# EAGLE schematic H02 (EAGLE 6.6.0)

## Sheet 1 of 3
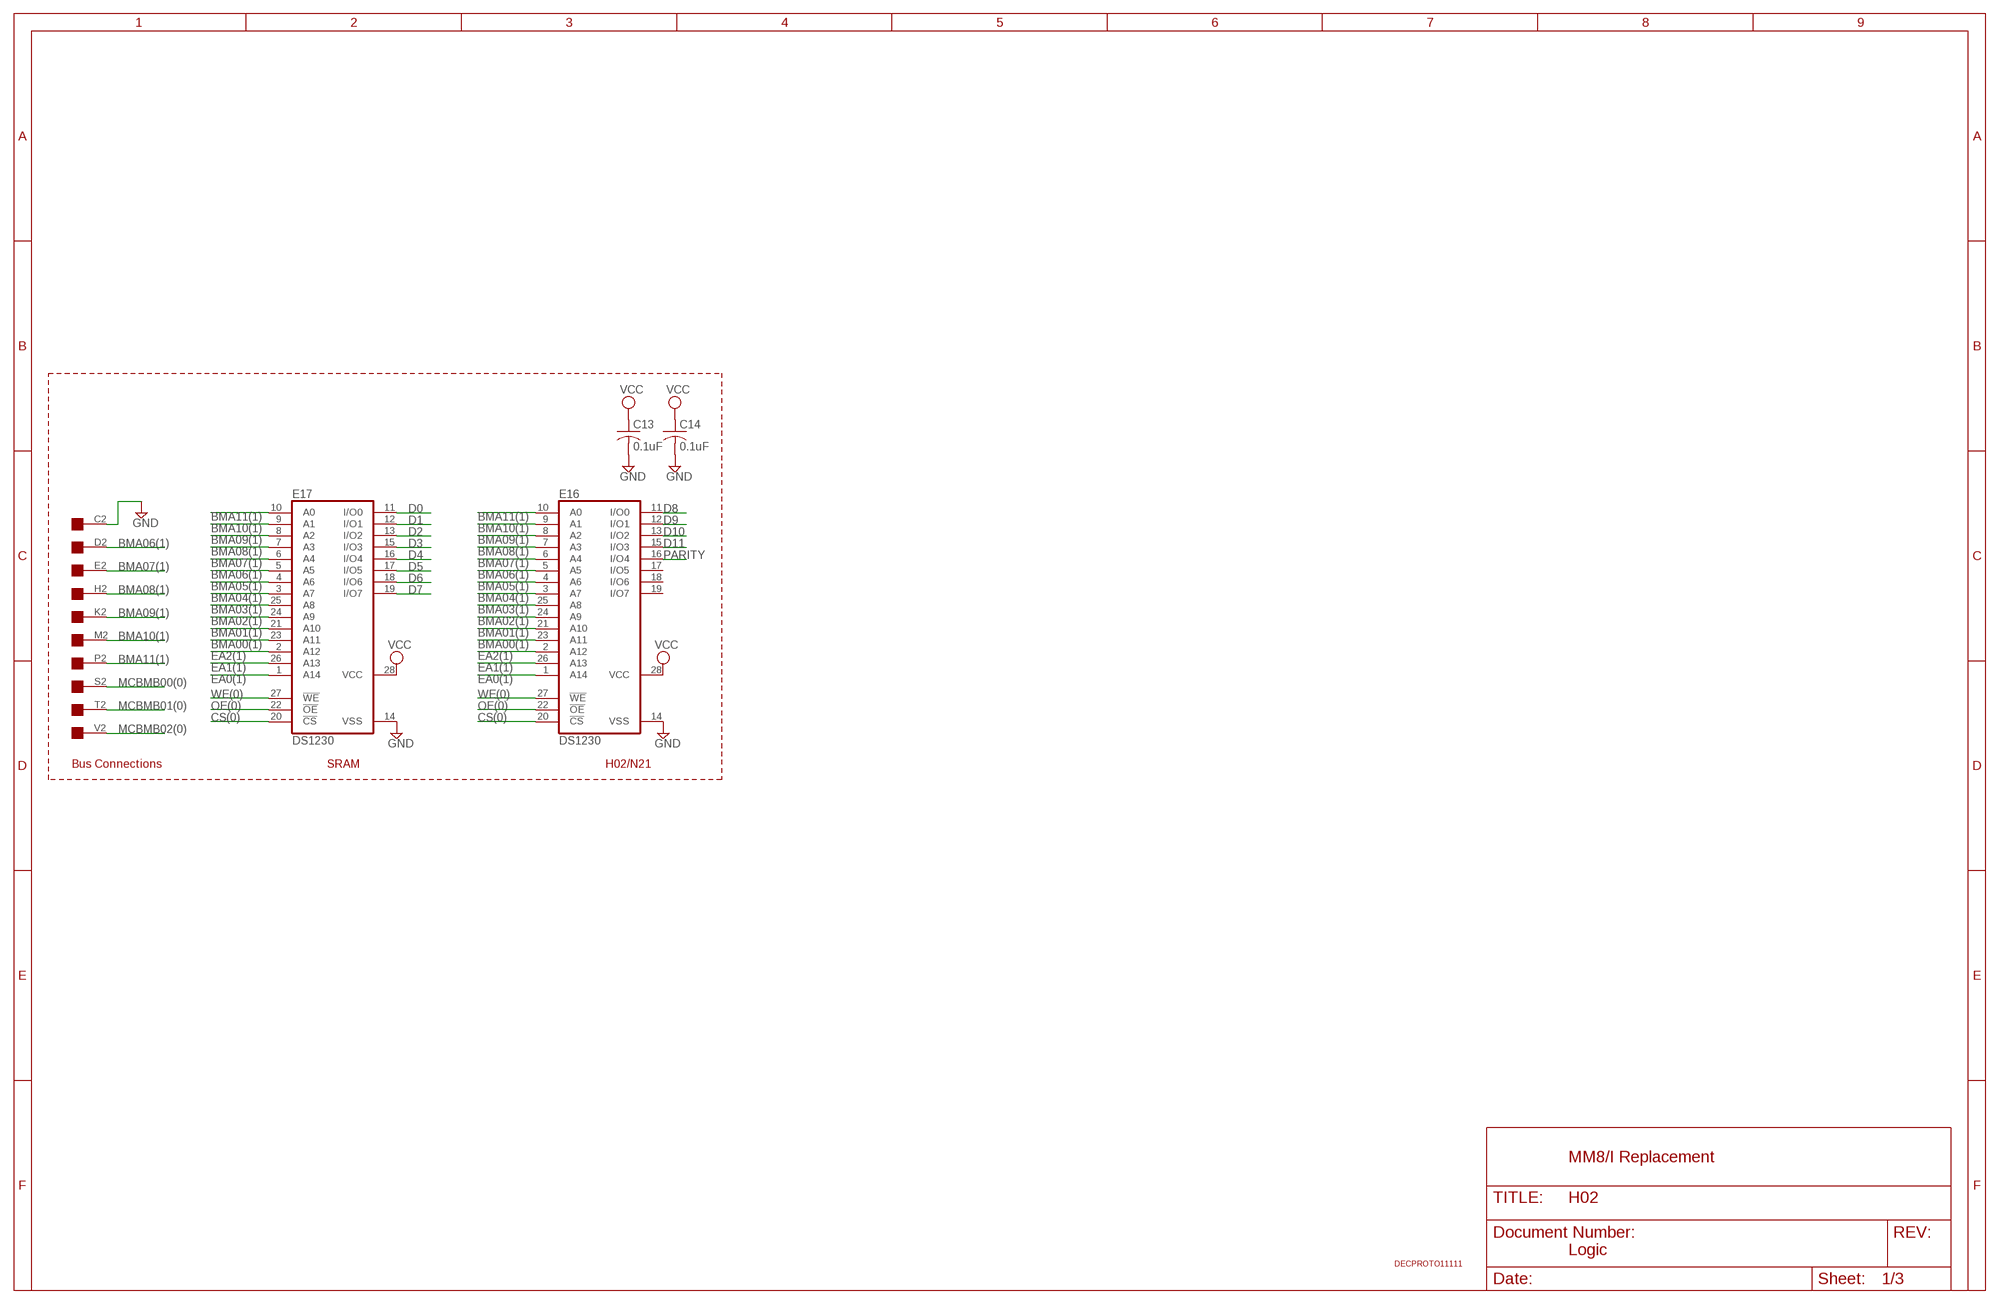
[diagram p0: schematic, sheet 1]

### Parts
C13  0.1uF  C-US050-025X075  [C050-025X075]
C14  0.1uF  C-US050-025X075  [C050-025X075]
E16  DS1230  62256P  [DIL28-6]
E17  DS1230  62256P  [DIL28-6]
H02  EDGE-1  [EDGE-CON1]
U$6  DECPROTO11111  [DECPROTO11111]

### Nets
BMA00(1): E16.23(A11) E17.23(A11) ; also sheet 2
BMA01(1): E16.21(A10) E17.21(A10) ; also sheet 2
BMA02(1): E16.24(A9) E17.24(A9) ; also sheet 2
BMA03(1): E16.25(A8) E17.25(A8) ; also sheet 2
BMA04(1): E16.3(A7) E17.3(A7) ; also sheet 2
BMA05(1): E16.4(A6) E17.4(A6) ; also sheet 2
BMA06(1): E16.5(A5) E17.5(A5) H02.D2 ; also sheet 2
BMA07(1): E16.6(A4) E17.6(A4) H02.E2 ; also sheet 2
BMA08(1): E16.7(A3) E17.7(A3) H02.H2 ; also sheet 2
BMA09(1): E16.8(A2) E17.8(A2) H02.K2 ; also sheet 2
BMA10(1): E16.9(A1) E17.9(A1) H02.M2 ; also sheet 2
BMA11(1): E16.10(A0) E17.10(A0) H02.P2 ; also sheet 2
CS(0): E16.20(!CS) E17.20(!CS) ; also sheet 2
D0: E17.11(I/O0) ; also sheet 2
D1: E17.12(I/O1) ; also sheet 2
D2: E17.13(I/O2) ; also sheet 2
D3: E17.15(I/O3) ; also sheet 2
D4: E17.16(I/O4) ; also sheet 2
D5: E17.17(I/O5) ; also sheet 2
D6: E17.18(I/O6) ; also sheet 2
D7: E17.19(I/O7) ; also sheet 2
D8: E16.11(I/O0) ; also sheet 2
D9: E16.12(I/O1) ; also sheet 2
D10: E16.13(I/O2) ; also sheet 2
D11: E16.15(I/O3) ; also sheet 2
EA0(1): E16.1(A14) E17.1(A14) ; also sheet 2
EA1(1): E16.26(A13) E17.26(A13) ; also sheet 2
EA2(1): E16.2(A12) E17.2(A12) ; also sheet 2
GND [supply]: C13.2 C14.2 E16.14(VSS) E17.14(VSS) H02.C2 ; also sheet 2
MCBMB00(0): H02.S2 ; also sheet 2
MCBMB01(0): H02.T2 ; also sheet 2
MCBMB02(0): H02.V2 ; also sheet 2
OE(0): E16.22(!OE) E17.22(!OE) ; also sheet 2
PARITY: E16.16(I/O4) ; also sheet 2
VCC [supply]: C13.1 C14.1 E16.28(VCC) E17.28(VCC) ; also sheet 2
WE(0): E16.27(!WE) E17.27(!WE) ; also sheet 2
Unconnected: E16.17(I/O5) E16.18(I/O6) E16.19(I/O7) H02.A2 H02.B2 H02.F2 H02.J2 H02.L2 H02.N2 H02.R2 H02.U2

### Notes on the sheet
- Bus Connections | SRAM | H02/N21
- MM8/I Replacement
- Logic

## Sheet 2 of 3
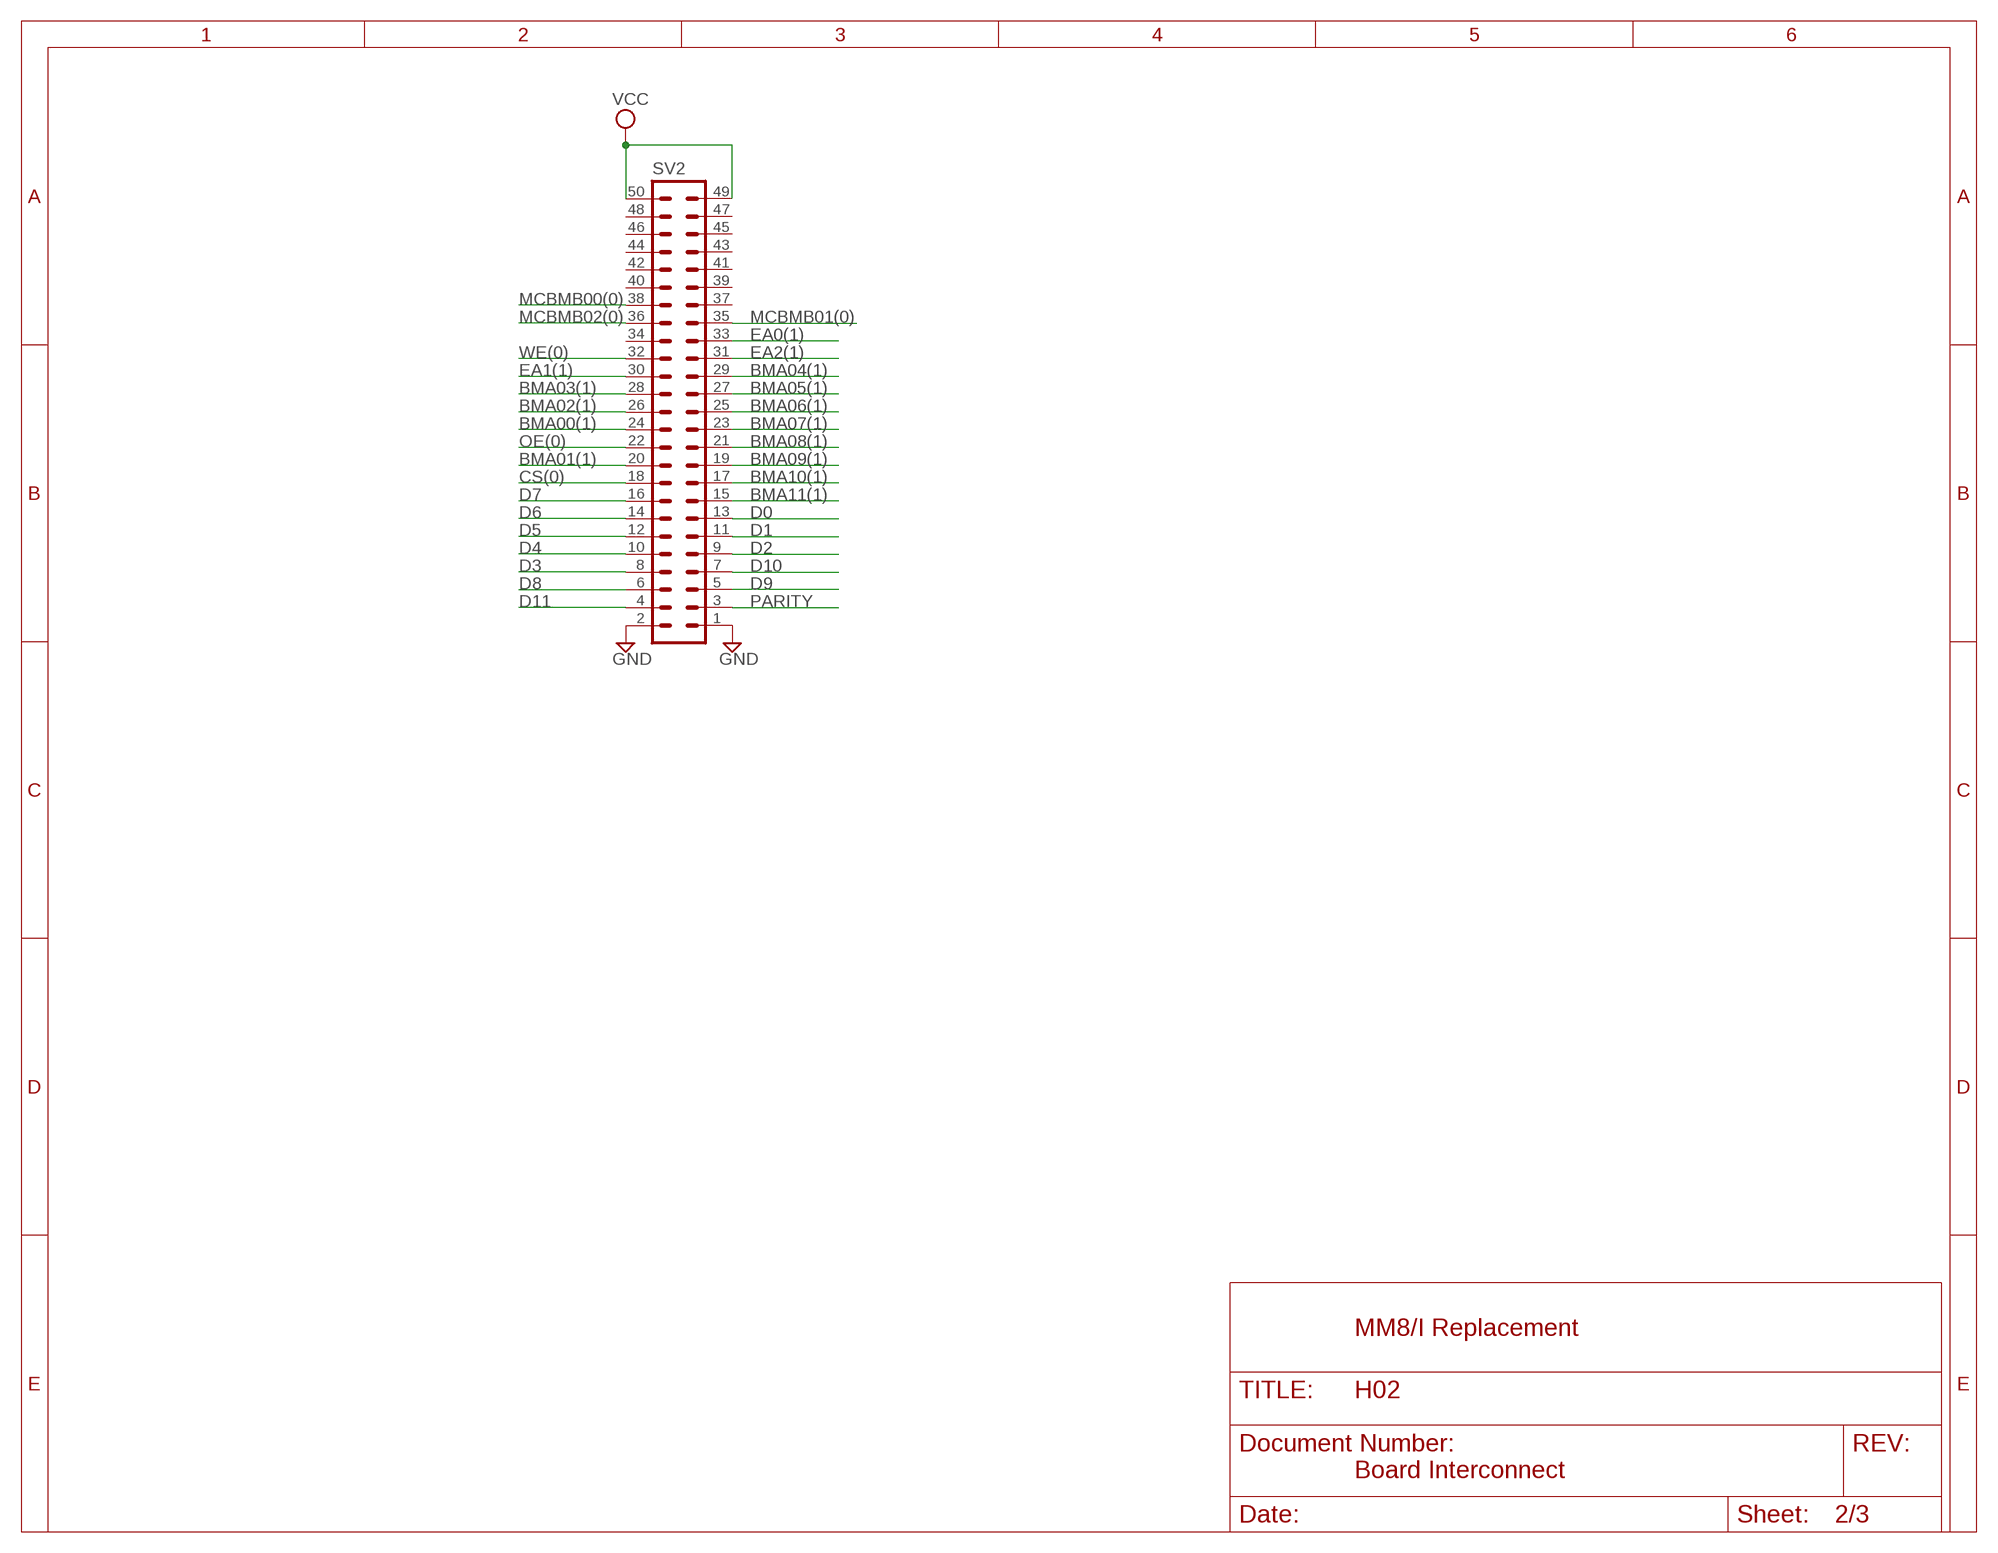
[diagram p1: schematic, sheet 2]

### Parts
SV2  ML50L  [ML50L]

### Nets
BMA00(1): SV2.24 ; also sheet 1
BMA01(1): SV2.20 ; also sheet 1
BMA02(1): SV2.26 ; also sheet 1
BMA03(1): SV2.28 ; also sheet 1
BMA04(1): SV2.29 ; also sheet 1
BMA05(1): SV2.27 ; also sheet 1
BMA06(1): SV2.25 ; also sheet 1
BMA07(1): SV2.23 ; also sheet 1
BMA08(1): SV2.21 ; also sheet 1
BMA09(1): SV2.19 ; also sheet 1
BMA10(1): SV2.17 ; also sheet 1
BMA11(1): SV2.15 ; also sheet 1
CS(0): SV2.18 ; also sheet 1
D0: SV2.13 ; also sheet 1
D1: SV2.11 ; also sheet 1
D2: SV2.9 ; also sheet 1
D3: SV2.8 ; also sheet 1
D4: SV2.10 ; also sheet 1
D5: SV2.12 ; also sheet 1
D6: SV2.14 ; also sheet 1
D7: SV2.16 ; also sheet 1
D8: SV2.6 ; also sheet 1
D9: SV2.5 ; also sheet 1
D10: SV2.7 ; also sheet 1
D11: SV2.4 ; also sheet 1
EA0(1): SV2.33 ; also sheet 1
EA1(1): SV2.30 ; also sheet 1
EA2(1): SV2.31 ; also sheet 1
GND [supply]: SV2.1 SV2.2 ; also sheet 1
MCBMB00(0): SV2.38 ; also sheet 1
MCBMB01(0): SV2.35 ; also sheet 1
MCBMB02(0): SV2.36 ; also sheet 1
OE(0): SV2.22 ; also sheet 1
PARITY: SV2.3 ; also sheet 1
VCC [supply]: SV2.49 SV2.50 ; also sheet 1
WE(0): SV2.32 ; also sheet 1
Unconnected: SV2.34 SV2.37 SV2.39 SV2.40 SV2.41 SV2.42 SV2.43 SV2.44 SV2.45 SV2.46 SV2.47 SV2.48

### Notes on the sheet
- MM8/I Replacement
- Board Interconnect

## Sheet 3 of 3
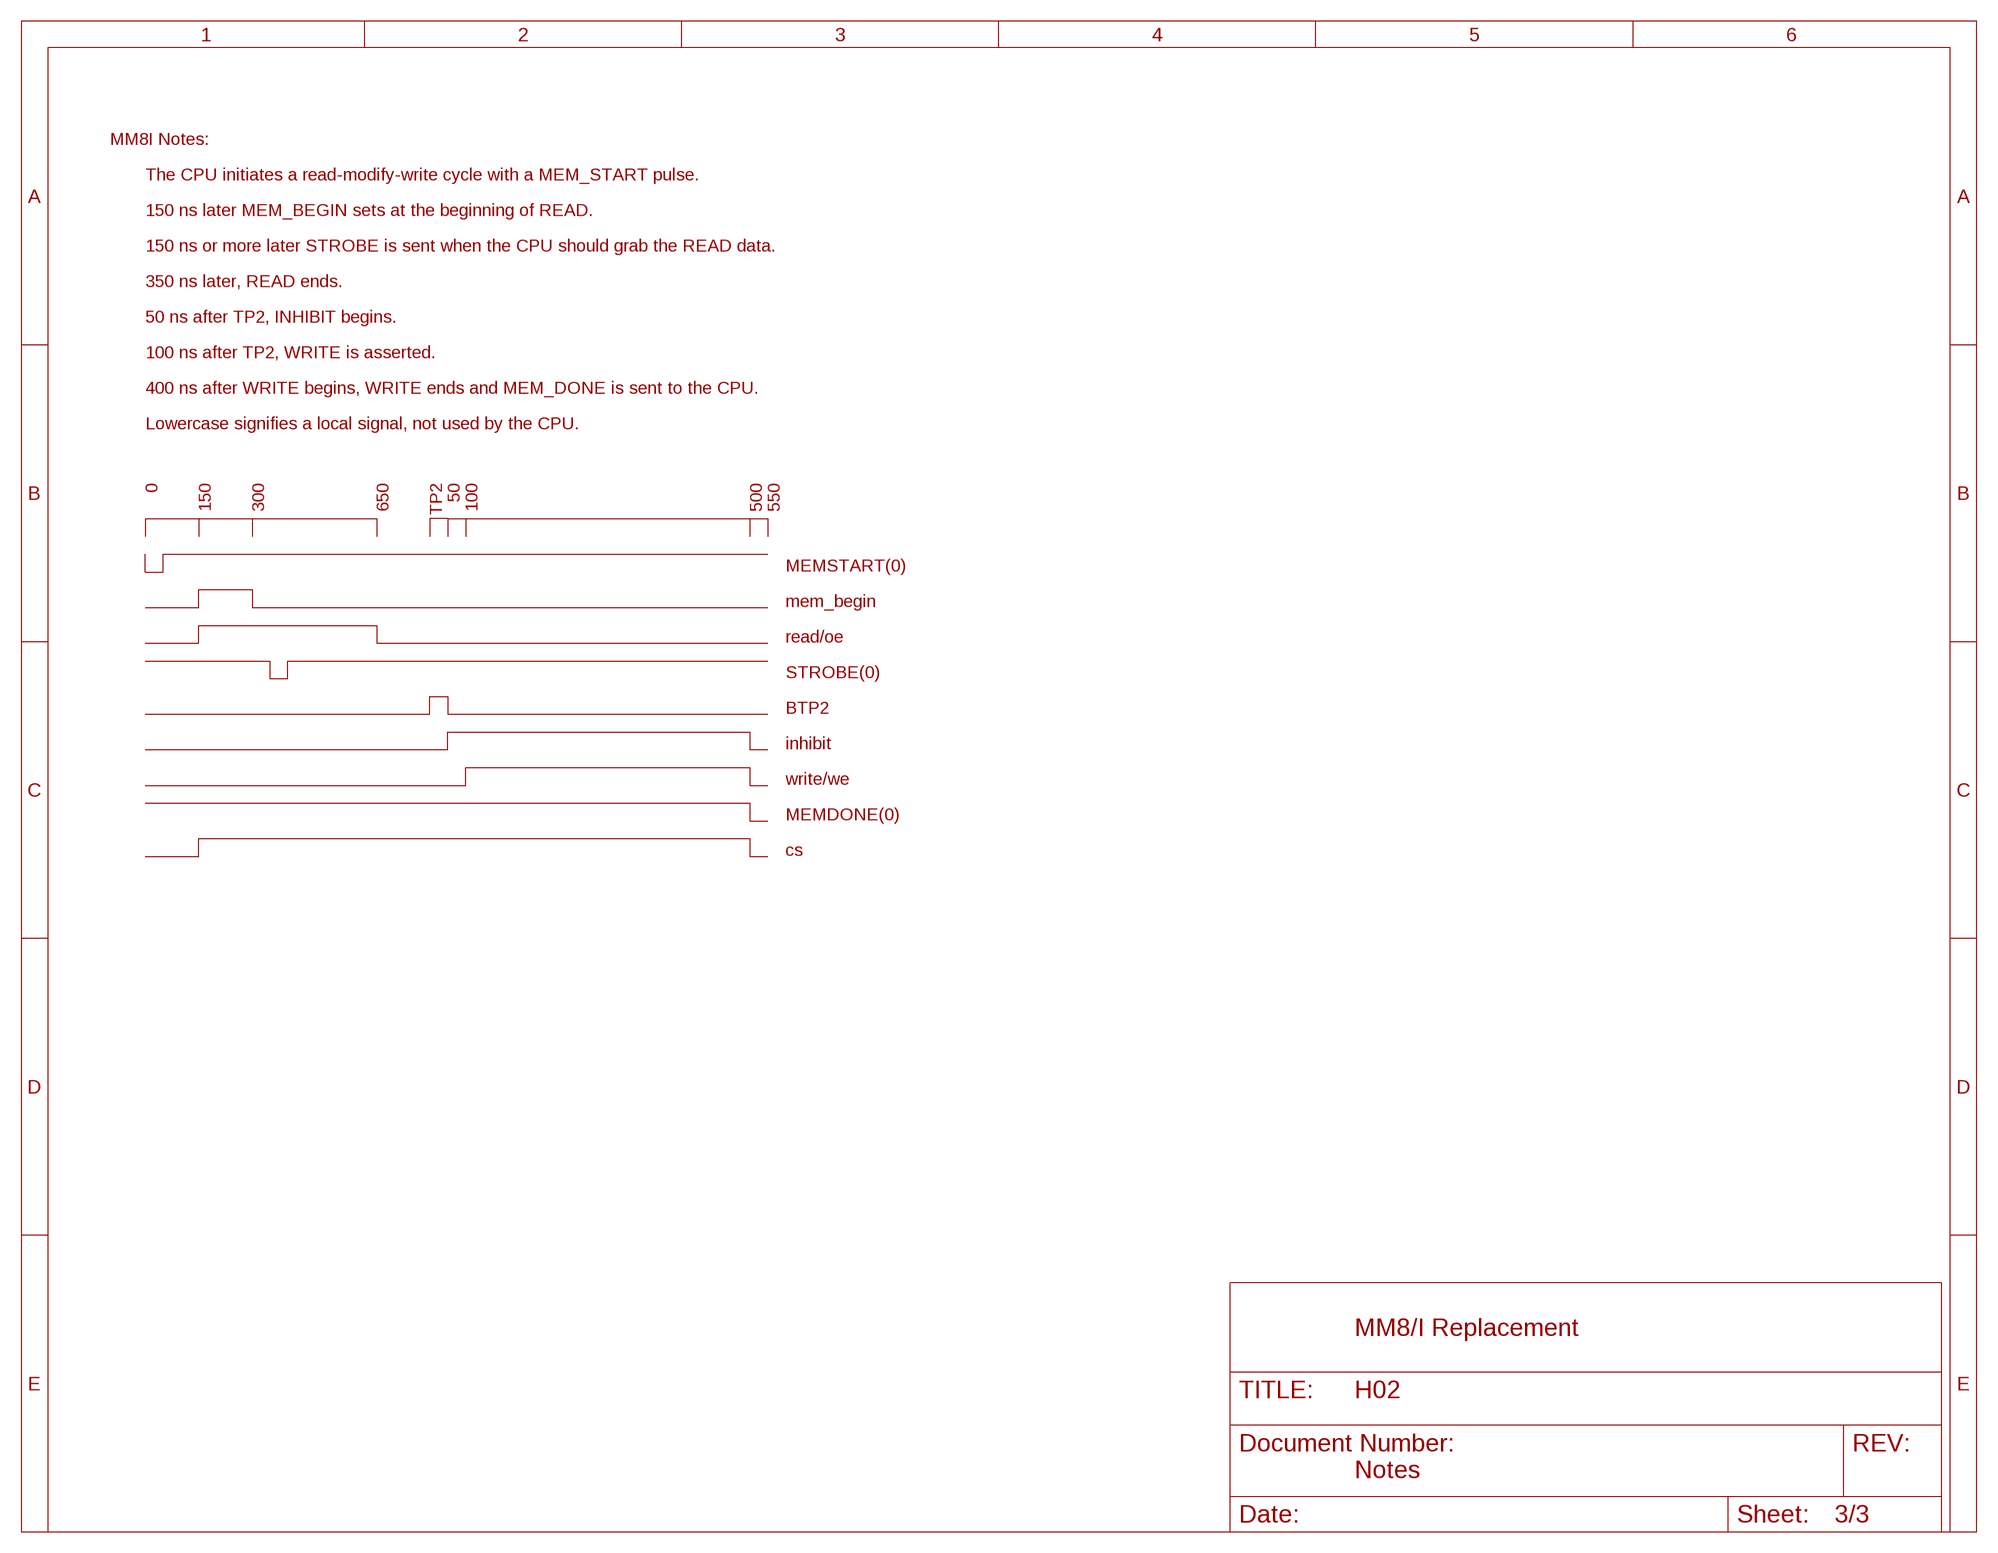
[diagram p2: schematic, sheet 3]

### Notes on the sheet
- MM8I Notes:
- The CPU initiates a read-modify-write cycle with a MEM_START pulse.
- 150 ns later MEM_BEGIN sets at the beginning of READ.
- 150 ns or more later STROBE is sent when the CPU should grab the READ data.
- 350 ns later, READ ends.
- 50 ns after TP2, INHIBIT begins.
- 100 ns after TP2, WRITE is asserted.
- 400 ns after WRITE begins, WRITE ends and MEM_DONE is sent to the CPU.
- Lowercase signifies a local signal, not used by the CPU.
- 0 | 150 | 300 | 650 | TP2 | 50 | 100 | 500 | 550
- MEMSTART(0)
- mem_begin
- read/oe
- STROBE(0)
- BTP2
- inhibit
- write/we
- MEMDONE(0)
- cs
- MM8/I Replacement
- Notes

## Library data of the parts
C13 C14 = rcl:C-US: CAPACITOR, American symbol
E16 E17 = memory-hitachi:62256P: MEMORY; OC_FARNELL: unknown; OC_NEWARK: unknown
H02 = dec-con:EDGE-1: Single-Sided DEC Edge Connector -- (side 2)
SV2 = con-ml:ML50L: HARTING; OC_FARNELL: unknown; OC_NEWARK: unknown
U$6 = dec-con:DECPROTO: Various small DEC boards stuck together with break-away tab routing.

## Net classes
1 supply: width 0.711 mm